# Altium schematic sheet MB1361_Top.SchDoc: Top: hierarchical view
size A4; Date: Not used; ApprovedBy: Not used; CheckedBy: Not used; Author: Not used; CompanyName: STMicroelectronics; DrawnBy: Not used; Engineer: Not used; Organization: Not used; Address1: Not used; Address2: Not used; Address3: Not used; Address4: Not used; DocumentNumber: 2; Revision: A-01-P3; SheetNumber: 2; SheetTotal: 9; CurrentTime: Not used; CurrentDate: Not used; Time: Not used; DocumentFullPathAndName: Not used; DocumentName: Not used; ModifiedDate: Not used; ImagePath: Not used; ProjectName: Not used; Application_BuildNumber: Not used
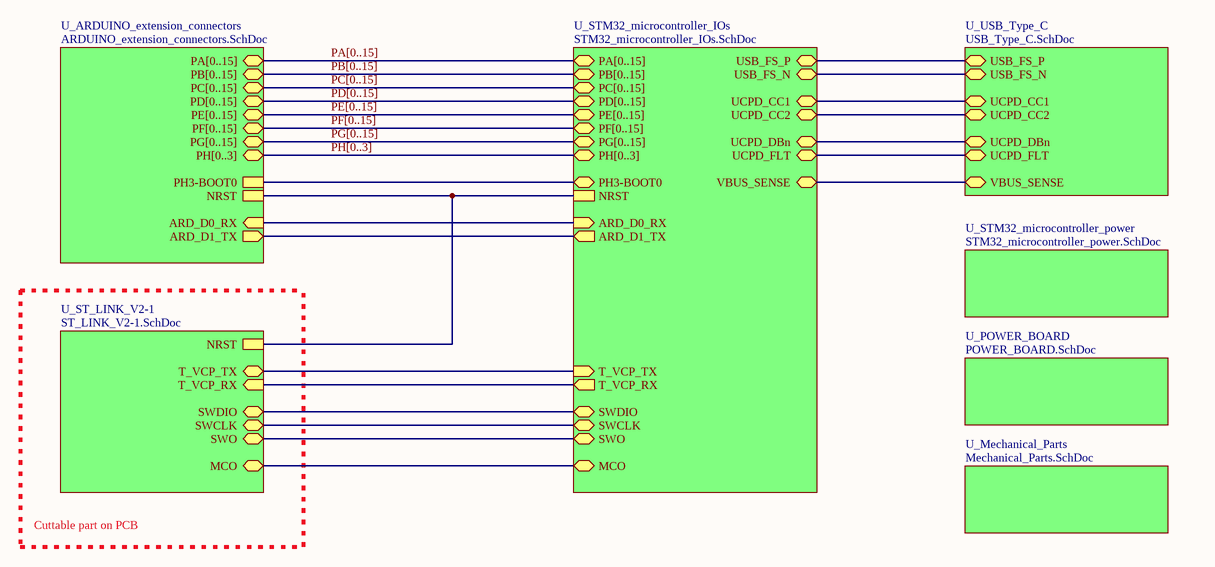
[diagram p0: MB1361_Top.SchDoc]

## Sub-sheets
U_ARDUINO_extension_connectors = ARDUINO_extension_connectors.SchDoc: PA[0..15] (bidir), PB[0..15] (bidir), PC[0..15] (bidir), NRST, PH3-BOOT0, PD[0..15] (bidir), PE[0..15] (bidir), PF[0..15] (bidir), PG[0..15] (bidir), PH[0..3] (bidir), ARD_D0_RX (in), ARD_D1_TX (out)
U_Mechanical_Parts = Mechanical_Parts.SchDoc: no entries
U_POWER_BOARD = POWER_BOARD.SchDoc: no entries
U_ST_LINK_V2-1 = ST_LINK_V2-1.SchDoc: NRST, SWO, SWCLK, MCO, SWDIO, T_VCP_TX, T_VCP_RX (in)
U_STM32_microcontroller_IOs = STM32_microcontroller_IOs.SchDoc: NRST, PA[0..15] (bidir), PB[0..15] (bidir), PC[0..15] (bidir), PD[0..15] (bidir), PE[0..15] (bidir), USB_FS_N (bidir), USB_FS_P (bidir), PF[0..15] (bidir), PG[0..15] (bidir), PH[0..3] (bidir), PH3-BOOT0, ARD_D0_RX (in), ARD_D1_TX (out), SWO, MCO, SWCLK, SWDIO, VBUS_SENSE, T_VCP_RX (out), T_VCP_TX (in), UCPD_CC2 (bidir), UCPD_CC1 (bidir), UCPD_FLT, UCPD_DBn
U_STM32_microcontroller_power = STM32_microcontroller_power.SchDoc: no entries
U_USB_Type_C = USB_Type_C.SchDoc: USB_FS_N (bidir), USB_FS_P (bidir), VBUS_SENSE, UCPD_CC1 (bidir), UCPD_CC2 (bidir), UCPD_DBn, UCPD_FLT

## Nets
(unnamed): sheet U_STM32_microcontroller_IOs/NRST, sheet U_ST_LINK_V2-1/NRST, sheet U_ARDUINO_extension_connectors/NRST
(unnamed): sheet U_STM32_microcontroller_IOs/USB_FS_N, sheet U_USB_Type_C/USB_FS_N
(unnamed): sheet U_STM32_microcontroller_IOs/USB_FS_P, sheet U_USB_Type_C/USB_FS_P
(unnamed): sheet U_STM32_microcontroller_IOs/PH3-BOOT0, sheet U_ARDUINO_extension_connectors/PH3-BOOT0
(unnamed): sheet U_STM32_microcontroller_IOs/ARD_D0_RX, sheet U_ARDUINO_extension_connectors/ARD_D0_RX
(unnamed): sheet U_STM32_microcontroller_IOs/ARD_D1_TX, sheet U_ARDUINO_extension_connectors/ARD_D1_TX
(unnamed): sheet U_STM32_microcontroller_IOs/SWO, sheet U_ST_LINK_V2-1/SWO
(unnamed): sheet U_STM32_microcontroller_IOs/MCO, sheet U_ST_LINK_V2-1/MCO
(unnamed): sheet U_STM32_microcontroller_IOs/SWCLK, sheet U_ST_LINK_V2-1/SWCLK
(unnamed): sheet U_STM32_microcontroller_IOs/SWDIO, sheet U_ST_LINK_V2-1/SWDIO
(unnamed): sheet U_STM32_microcontroller_IOs/VBUS_SENSE, sheet U_USB_Type_C/VBUS_SENSE
(unnamed): sheet U_STM32_microcontroller_IOs/T_VCP_RX, sheet U_ST_LINK_V2-1/T_VCP_RX
(unnamed): sheet U_STM32_microcontroller_IOs/T_VCP_TX, sheet U_ST_LINK_V2-1/T_VCP_TX
(unnamed): sheet U_STM32_microcontroller_IOs/UCPD_CC2, sheet U_USB_Type_C/UCPD_CC2
(unnamed): sheet U_STM32_microcontroller_IOs/UCPD_CC1, sheet U_USB_Type_C/UCPD_CC1
(unnamed): sheet U_STM32_microcontroller_IOs/UCPD_FLT, sheet U_USB_Type_C/UCPD_FLT
(unnamed): sheet U_STM32_microcontroller_IOs/UCPD_DBn, sheet U_USB_Type_C/UCPD_DBn

## Buses and harness runs
bus PA[0..15] = sheet U_ARDUINO_extension_connectors/PA[0..15] = sheet U_STM32_microcontroller_IOs/PA[0..15]
bus PB[0..15] = sheet U_ARDUINO_extension_connectors/PB[0..15] = sheet U_STM32_microcontroller_IOs/PB[0..15]
bus PC[0..15] = sheet U_ARDUINO_extension_connectors/PC[0..15] = sheet U_STM32_microcontroller_IOs/PC[0..15]
bus PD[0..15] = sheet U_ARDUINO_extension_connectors/PD[0..15] = sheet U_STM32_microcontroller_IOs/PD[0..15]
bus PE[0..15] = sheet U_ARDUINO_extension_connectors/PE[0..15] = sheet U_STM32_microcontroller_IOs/PE[0..15]
bus PF[0..15] = sheet U_ARDUINO_extension_connectors/PF[0..15] = sheet U_STM32_microcontroller_IOs/PF[0..15]
bus PG[0..15] = sheet U_ARDUINO_extension_connectors/PG[0..15] = sheet U_STM32_microcontroller_IOs/PG[0..15]
bus PH[0..3] = sheet U_ARDUINO_extension_connectors/PH[0..3] = sheet U_STM32_microcontroller_IOs/PH[0..3]

## Notes on the sheet
- Cuttable part on PCB
- Title:
- Project:
- Size:
- Revision:
- Variant:
- A4
- -
- Date:
- Reference:
- Sheet:
- of